# Altium schematic sheet Sheet1.SchDoc
size A4
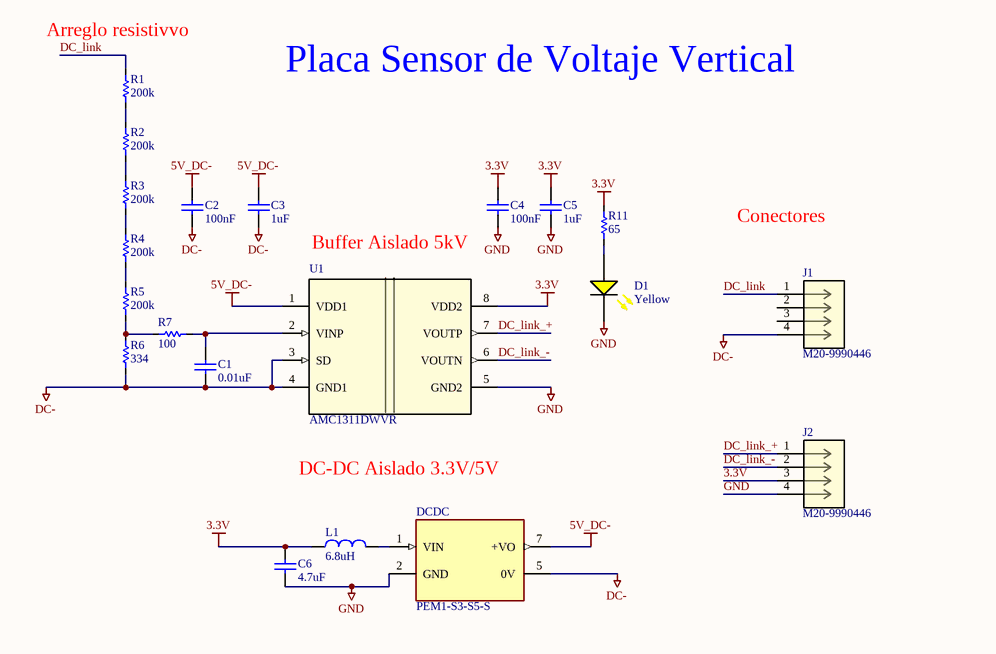
[diagram p0: Sheet1.SchDoc]

## Parts
C1  0.01uF  [CAP_0603]
C2  100nF  [CAP_0603]
C3  1uF  [CAP_0603]
C4  100nF  [CAP_0603]
C5  1uF  [CAP_0603]
C6  4.7uF  [CAP_0805]
D1  Yellow  [LED_0603_Yellow]
DCDC  PEM1-S3-S5-S  [CONV_PEM1-S3-S5-S]
J1  M20-9990446  [CONN_M20_4_HRW]
J2  M20-9990446  [CONN_M20_4_HRW]
L1  6.8uH  [INDUCTOR_1210]
R1  200k  [RES_0603]
R2  200k  [RES_0603]
R3  200k  [RES_0603]
R4  200k  [RES_0603]
R5  200k  [RES_0603]
R6  334  [RES_0603]
R7  100  [RES_0603]
R11  65  [RES_0603]
U1  AMC1311DWVR  [DWV0008A]

## Nets
3.3V: C4.1 C5.1 C6.1 J2.3 L1.1 R11.2 U1.8(VDD2)
5V_DC-: C2.1 C3.1 DCDC.7(+VO) U1.1(VDD1)
DC-: C1.2 C2.2 C3.2 DCDC.5(0V) J1.4 R6.1 U1.3(SD) U1.4(GND1)
GND: C4.2 C5.2 C6.2 D1.2(K) DCDC.2(GND) J2.4 U1.5(GND2)
DC_link: J1.1 R1.2
DC_link_+: J2.1 U1.7(VOUTP)
DC_link_-: J2.2 U1.6(VOUTN)
NetC1_1: C1.1 R7.1 U1.2(VINP)
NetD1_1: D1.1(A) R11.1
NetDCDC_1: DCDC.1(VIN) L1.2
NetR1_1: R1.1 R2.2
NetR2_1: R2.1 R3.2
NetR3_1: R3.1 R4.2
NetR4_1: R4.1 R5.2
NetR5_1: R5.1 R6.2 R7.2

Not connected (* = marked no-connect by the designer): J1 2 3

## Notes on the sheet
- (near R1) Arreglo resistivvo
- Placa Sensor de Voltaje Vertical
- (near C4) Buffer Aislado 5kV
- Conectores
- DC-DC Aislado 3.3V/5V

## Library data of the parts
C1 C3 C5 = Cap_0603: 0.1µF ±10% 50V Ceramic Capacitor X7R 0603 (1608 Metric); MF: KEMET; MFP: C0603C104K5RACTU; Value: 100nF; Created: 2020_06_15_DAarancibia; Package: 0603; Supplier 1: Digi-Key; Supplier Part Number 1: 399-5089-1-ND
C2 C4 = Cap_0603: 0.1µF ±10% 50V Ceramic Capacitor X7R 0603 (1608 Metric); MF: KEMET; MFP: C0603C104K5RACTU; Created: 2020_06_15_DAarancibia; Package: 0603; Value: 100nF; Supplier 1: Digi-Key; Supplier Part Number 1: 399-5089-1-ND
C6 = Cap_0805: 0.1µF ±10% 50V Ceramic Capacitor X7R 0805 (2012 Metric); MF: KEMET; MFP: C0805C104K5RACTU; Value: 100nF; Created: 2020_06_15_DAarancibia; Package: 0805; Supplier 1: Digi-Key; Supplier Part Number 1: 399-1170-1-ND
D1 = Led_0603_Yellow: Yellow 590nm LED Indication - Discrete 2V 0603 (1608 Metric); MF: Würth Elektronik; MFP: 150060YS75000; Created: 2020_07_06_DAarancibia; Package: 0603; Value: Yellow; Supplier 1: Digi-Key; Supplier Part Number 1: 732-4981-1-ND
DCDC = PEM1-S3-S5-S: 12 Vdc, 0.083 A, 1 W, 10.8~13.2 Vdc Input Range; Package: None; Price: None; Value: *; MP: PEM1-S3-S5-S; Availability: Unavailable
J1 J2 = M20-9990446: No Description Available; Mfr_Name: Harwin; RefDes: RefDes; Type: Type
L1 = Inductor_1210: 10µH Unshielded Wirewound Inductor 700mA 350mOhm Max 1210 (3225 Metric); MF: Taiyo Yuden; MFP: BRL3225T100M; Value: 10uH; Created: 2020_07_06_DAarancibia; Package: 1210; Supplier 1: Digi-Key; Supplier Part Number 1: 587-5505-1-ND
R1-R7 R11 = Res_0603: 10 kOhms ±1% 0.1W, 1/10W Chip Resistor 0402 (1005 Metric) Anti-Sulfur, Automotive AEC-Q200 Thick Film; MF: Panasonic Electronic Components; MFP: ERJ-3EKF1002V; Value: 10k; Created: 2020_06_15_DAarancibia; Package: 0603; Supplier 1: Digi-Key; Supplier Part Number 1: P10.0KHCT-ND
U1 = AMC1311DWVR: No Description Available; Mfr_Name: Texas Instruments; TYPE: TYPE; RefDes: RefDes